# EasyEDA schematic SCH_Irrigador-Automático-Trato_2026-02-04.json
TITLE: Irrigador Trato; REV: 1.0; Date: 2025-08-09; Sheet: 1/1; Drawn By: João Saade; Company: UFMG
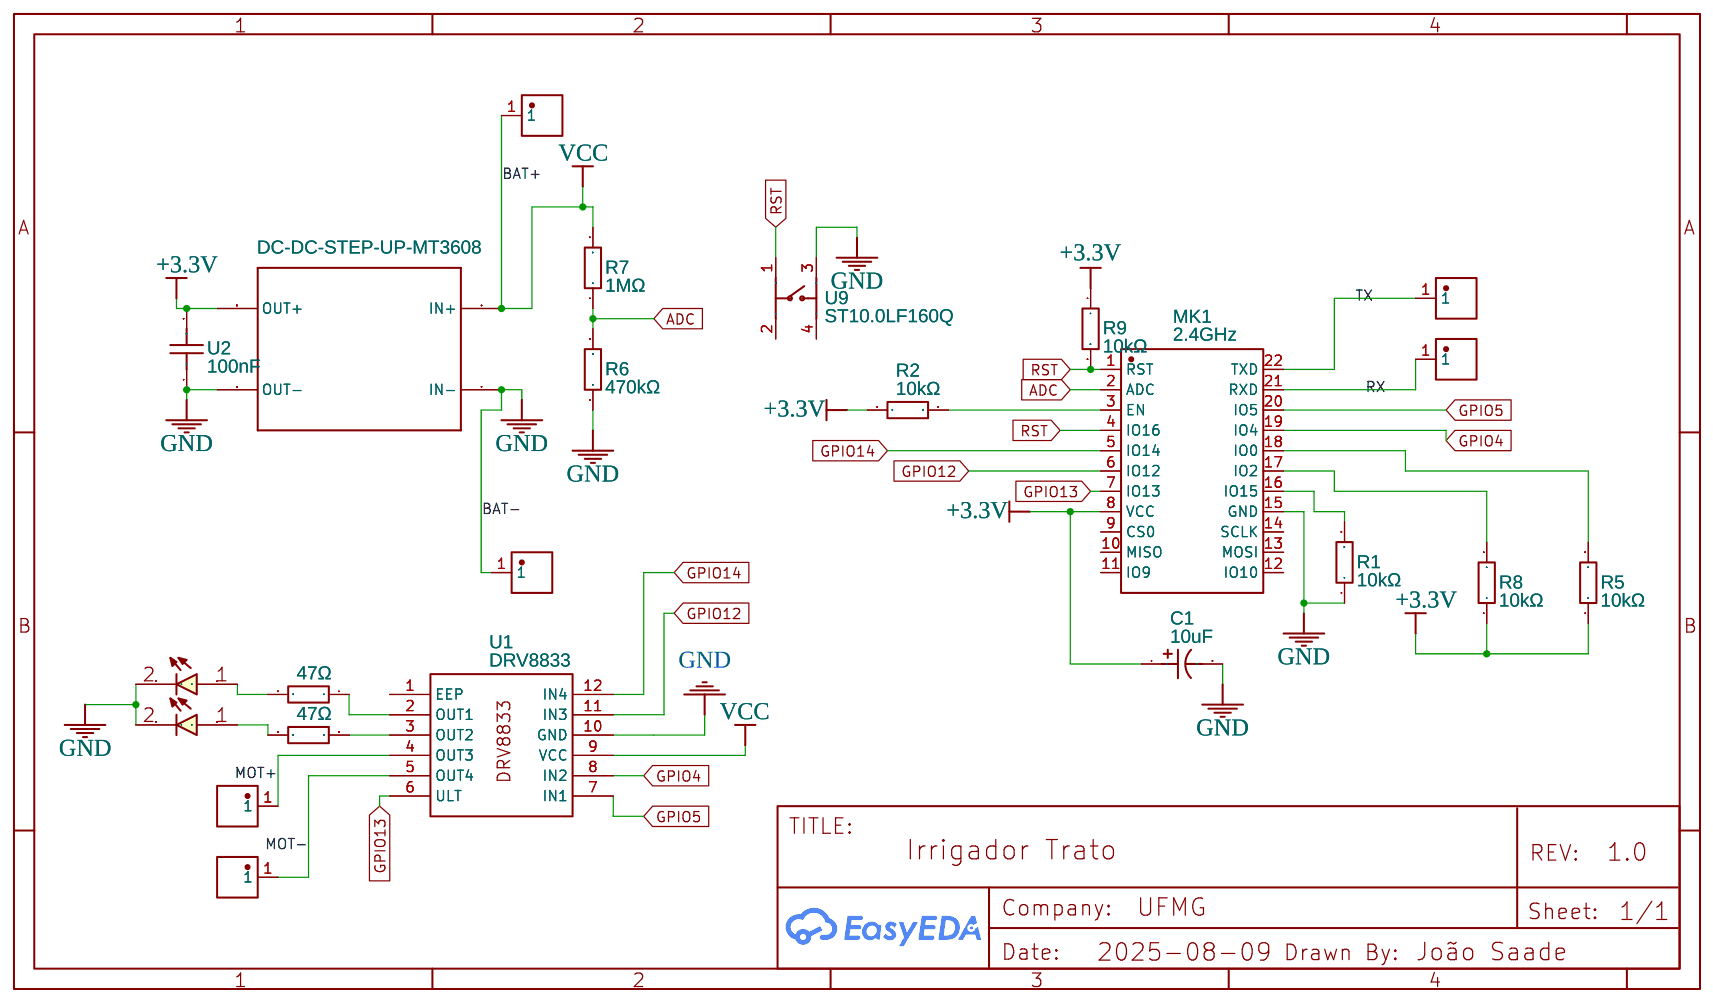
[diagram p0: schematic sheet]

## Parts
2  DC-DC-STEP-UP-MT3608  [DC-DC-STEP-UP-MT3608]
C1  10uF  [CAP-TH_BD5.0-P2.00-D0.5-FD-1]
LED3  LED-5MM-RED  [LED-5MM-5MM]
LED4  LED-5MM-GRE  [LED-5MM-5MM]
MK1  2.4GHz  [WIFIM-SMD_ESP-12E-BR]
R1  10kΩ  [RES-TH_BD2.3-L6.5-P10.50-D0.5]
R2  10kΩ  [RES-TH_BD2.3-L6.5-P10.50-D0.5]
R3  47Ω  [RES-TH_BD2.3-L6.5-P10.50-D0.5]
R4  47Ω  [RES-TH_BD2.3-L6.5-P10.50-D0.5]
R5  10kΩ  [RES-TH_BD2.3-L6.5-P10.50-D0.5]
R6  470kΩ  [RES-TH_BD2.3-L6.5-P10.50-D0.5]
R7  1MΩ  [RES-TH_BD2.3-L6.5-P10.50-D0.5]
R8  10kΩ  [RES-TH_BD2.3-L6.5-P10.50-D0.5]
R9  10kΩ  [RES-TH_BD2.3-L6.5-P10.50-D0.5]
U1  DRV8833  [DRV8833]
U2  100nF  [CAP-TH_L3.7-W2.1-P5.08-D0.5]
U9  ST10.0LF160Q  [SW-TH_4P-L7.2-W7.2-P4.90-LS7.5]
U11  P70-2200045  [TESTPOINT-TH_BD2.0-D1.0_TESTPOINT-TH_BD2.0-D1.0]
U12  P70-2200045  [TESTPOINT-TH_BD2.0-D1.0_TESTPOINT-TH_BD2.0-D1.0]
U13  P70-2200045  [TESTPOINT-TH_BD2.0-D1.0_TESTPOINT-TH_BD2.0-D1.0]
U14  P70-2200045  [TESTPOINT-TH_BD2.0-D1.0_TESTPOINT-TH_BD2.0-D1.0]
U15  P70-2200045  [TESTPOINT-TH_BD2.0-D1.0_TESTPOINT-TH_BD2.0-D1.0]
U16  P70-2200045  [TESTPOINT-TH_BD2.0-D1.0_TESTPOINT-TH_BD2.0-D1.0]

## Library data of the parts
2 = DC-DC-STEP-UP-MT3608: Contributor: mratix
C1 = NXA50V10M5*11 2.5TP: Supplier: LCSC; Supplier Part: C3002459; Manufacturer: SAMYOUNG(韩国三莹); JLCPCB Part Class: Extended Part; Contributor: lcsc
LED3 = LED-5MM-RED: Contributor: MicroRobotics
LED4 = LED-5MM-GRE: Contributor: MicroRobotics
MK1 = ESP-12E: Supplier: LCSC; Manufacturer: Ai-Thinker(安信可); Supplier Part: C89297; JLCPCB Part Class: Extended Part
R1-R9 = CF1/4W-110KΩ±5% T52: Contributor: LCSC; Supplier: LCSC; Supplier Part: C120104; Manufacturer: CCO(千志电子); JLCPCB Part Class: Extended Part
U1 = DRV8833: Manufacturer: TI; Supplier: LCSC; link: https://www.ti.com/product/DRV8833; Contributor: bin.sun148
U2 = K104K10X7RF5UH5: Contributor: lcsc; Supplier: LCSC; Supplier Part: C2979769; Manufacturer: VISHAY(威世); JLCPCB Part Class: Extended Part
U9 = ST10.0LF160Q: Contributor: lcsc; Supplier: LCSC; Supplier Part: C4364808; Manufacturer: CIT Relay and Switch
U11-U16 = P70-2200045: Supplier: LCSC; Supplier Part: C21890164; Manufacturer: Harwin; JLCPCB Part Class: Extended Part; Contributor: lcsc

## Nets
+3.3V: 2.OUT+ C1.1 MK1.8(VCC) R2.2 R5.1 R8.1 R9.1 U2.2
ADC: MK1.2(ADC) R6.2 R7.1
BAT+: 2.IN+ R7.2 U1.9(VCC) U15.1
BAT-: 2.IN- 2.OUT- C1.2 LED3.2(K) LED4.2(K) MK1.15(GND) R1.1 R6.1 U1.10(GND) U2.1 U9.3 U16.1
GPIO4: MK1.19(IO4) U1.8(IN2)
GPIO5: MK1.20(IO5) U1.7(IN1)
GPIO12: MK1.6(IO12) U1.11(IN3)
GPIO13: MK1.7(IO13) U1.6(ULT)
GPIO14: MK1.5(IO14) U1.12(IN4)
MOT+: U1.4(OUT3) U12.1
MOT-: U1.5(OUT4) U11.1
RST: MK1.1(RST) MK1.4(IO16) R9.2 U9.1
RX: MK1.21(RXD) U13.1
TX: MK1.22(TXD) U14.1
Net-(LED3-1): LED3.1(A) R4.2
Net-(LED4-1): LED4.1(A) R3.2
Net-(MK1-3): MK1.3(EN) R2.1
Net-(MK1-16): MK1.16(IO15) R1.2
Net-(MK1-17): MK1.17(IO2) R8.2
Net-(MK1-18): MK1.18(IO0) R5.2
Net-(R3-1): R3.1 U1.2(OUT1)
Net-(R4-1): R4.1 U1.3(OUT2)

Not connected (* = marked no-connect by the designer): MK1 9(CS0) 10(MISO) 11(IO9) 12(IO10) 13(MOSI) 14(SCLK); U1 1(EEP); U9 2 4
